# Altium schematic sheet MIDDLE LAYER.SchDoc
size A
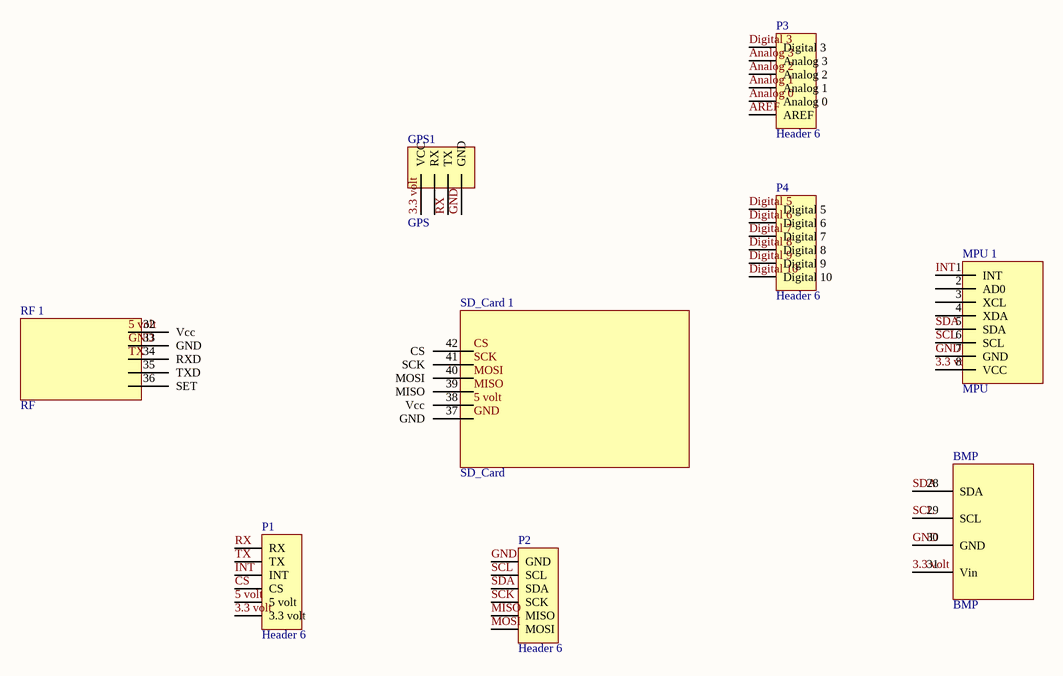
[diagram p0: MIDDLE LAYER.SchDoc]

## Parts
BMP  BMP  [BMP]
GPS1  GPS  [GPS]
MPU_1  MPU  [MPU]
P1  Header 6  [HDR1X6]
P2  Header 6  [HDR1X6]
P3  Header 6  [HDR1X6]
P4  Header 6  [HDR1X6]
RF_1  RF  [RF]
SD_Card_1  SD_Card  [SD_Card]

## Nets
3.3 volt: BMP.31(Vin) GPS1.12(VCC) MPU_1.8(VCC) P1.6(3.3_volt)
5 volt: P1.5(5_volt) RF_1.32(Vcc) SD_Card_1.38(Vcc)
Analog 0: P3.5(Analog_0)
Analog 1: P3.4(Analog_1)
Analog 2: P3.3(Analog_2)
Analog 3: P3.2(Analog_3)
AREF: P3.6(AREF)
CS: P1.4(CS) SD_Card_1.42(CS)
Digital 3: P3.1(Digital_3)
Digital 5: P4.1(Digital_5)
Digital 6: P4.2(Digital_6)
Digital 7: P4.3(Digital_7)
Digital 8: P4.4(Digital_8)
Digital 9: P4.5(Digital_9)
Digital 10: P4.6(Digital_10)
GND: BMP.30(GND) GPS1.15(GND) MPU_1.7(GND) P2.1(GND) RF_1.33(GND) SD_Card_1.37(GND)
INT: MPU_1.1(INT) P1.3(INT)
MISO: P2.5(MISO) SD_Card_1.39(MISO)
MOSI: P2.6(MOSI) SD_Card_1.40(MOSI)
RX: GPS1.14(TX) P1.1(RX)
SCK: P2.4(SCK) SD_Card_1.41(SCK)
SCL: BMP.29(SCL) MPU_1.6(SCL) P2.2(SCL)
SDA: BMP.28(SDA) MPU_1.5(SDA) P2.3(SDA)
TX: P1.2(TX) RF_1.34(RXD)

Not connected (* = marked no-connect by the designer): GPS1 13(RX); MPU_1 2(AD0) 3(XCL) 4(XDA); RF_1 35(TXD) 36(SET)

## Library data of the parts
P1-P4 = Header 6: Header, 6-Pin; LatestRevisionDate: 17-Jul-2002; LatestRevisionNote: Re-released for DXP Platform.; Publisher: Altium Limited